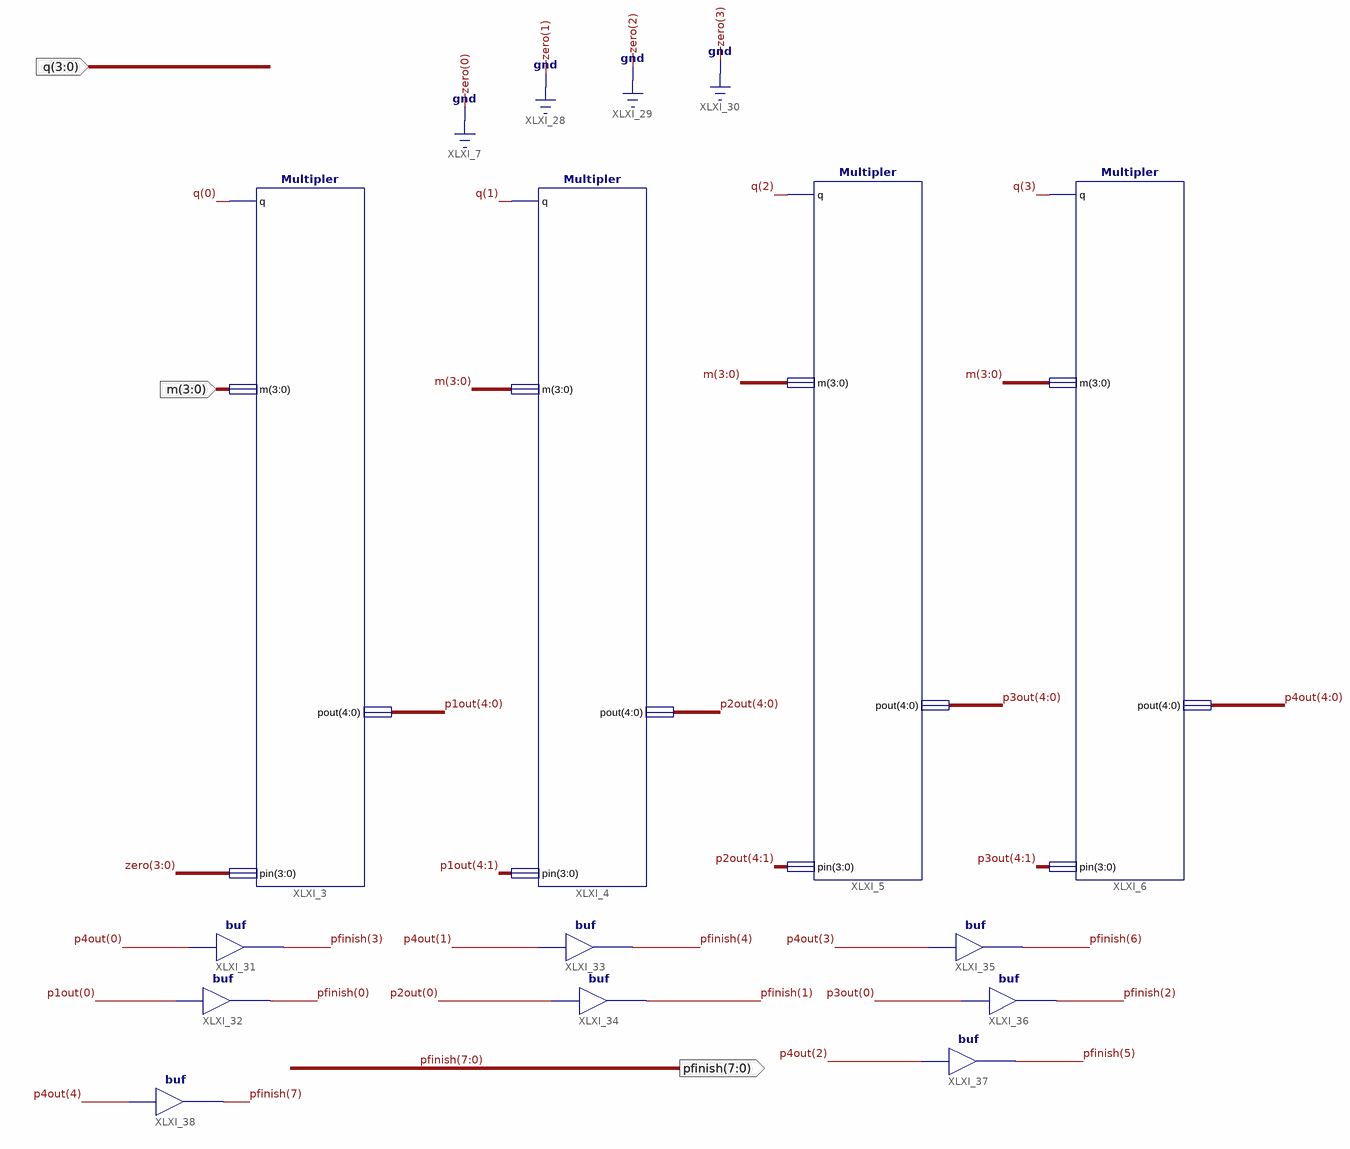
[diagram p0: schematic sheet 1]
// Xilinx ISE schematic Stage.sch (spartan3e) as structural Verilog: 12 symbols, 3 ports
module Stage (
  input  [3:0] q,
  input  [3:0] m,
  output [7:0] pfinish
);

  wire [4:0] p1out, p2out, p3out, p4out;

  Multipler XLXI_3 (.q(q[0]), .pin(4'b0000), .m(m), .pout(p1out));
  Multipler XLXI_4 (.q(q[1]), .pin(p1out[4:1]), .m(m), .pout(p2out));
  Multipler XLXI_5 (.q(q[2]), .pin(p2out[4:1]), .m(m), .pout(p3out));
  Multipler XLXI_6 (.q(q[3]), .pin(p3out[4:1]), .m(m), .pout(p4out));
  buf XLXI_31 (pfinish[3], p4out[0]);
  buf XLXI_32 (pfinish[0], p1out[0]);
  buf XLXI_33 (pfinish[4], p4out[1]);
  buf XLXI_34 (pfinish[1], p2out[0]);
  buf XLXI_35 (pfinish[6], p4out[3]);
  buf XLXI_36 (pfinish[2], p3out[0]);
  buf XLXI_37 (pfinish[5], p4out[2]);
  buf XLXI_38 (pfinish[7], p4out[4]);
endmodule
